# Altium schematic sheet 51-2001-01-13_04 Power Module Schematic.SchDoc
size 431 x 279 mm; Organization: ORGANIZATION; Address1: ADDRESS 1; Address2: ADDRESS 2; Address3: ADDRESS 3; Address4: ADDRESS 4; Revision: -; SheetNumber: 4; SheetTotal: 4; ENG_APP_DATE: --/--/--; DSN_APP_DATE: --/--/--; CHK_APP_DATE: --/--/--
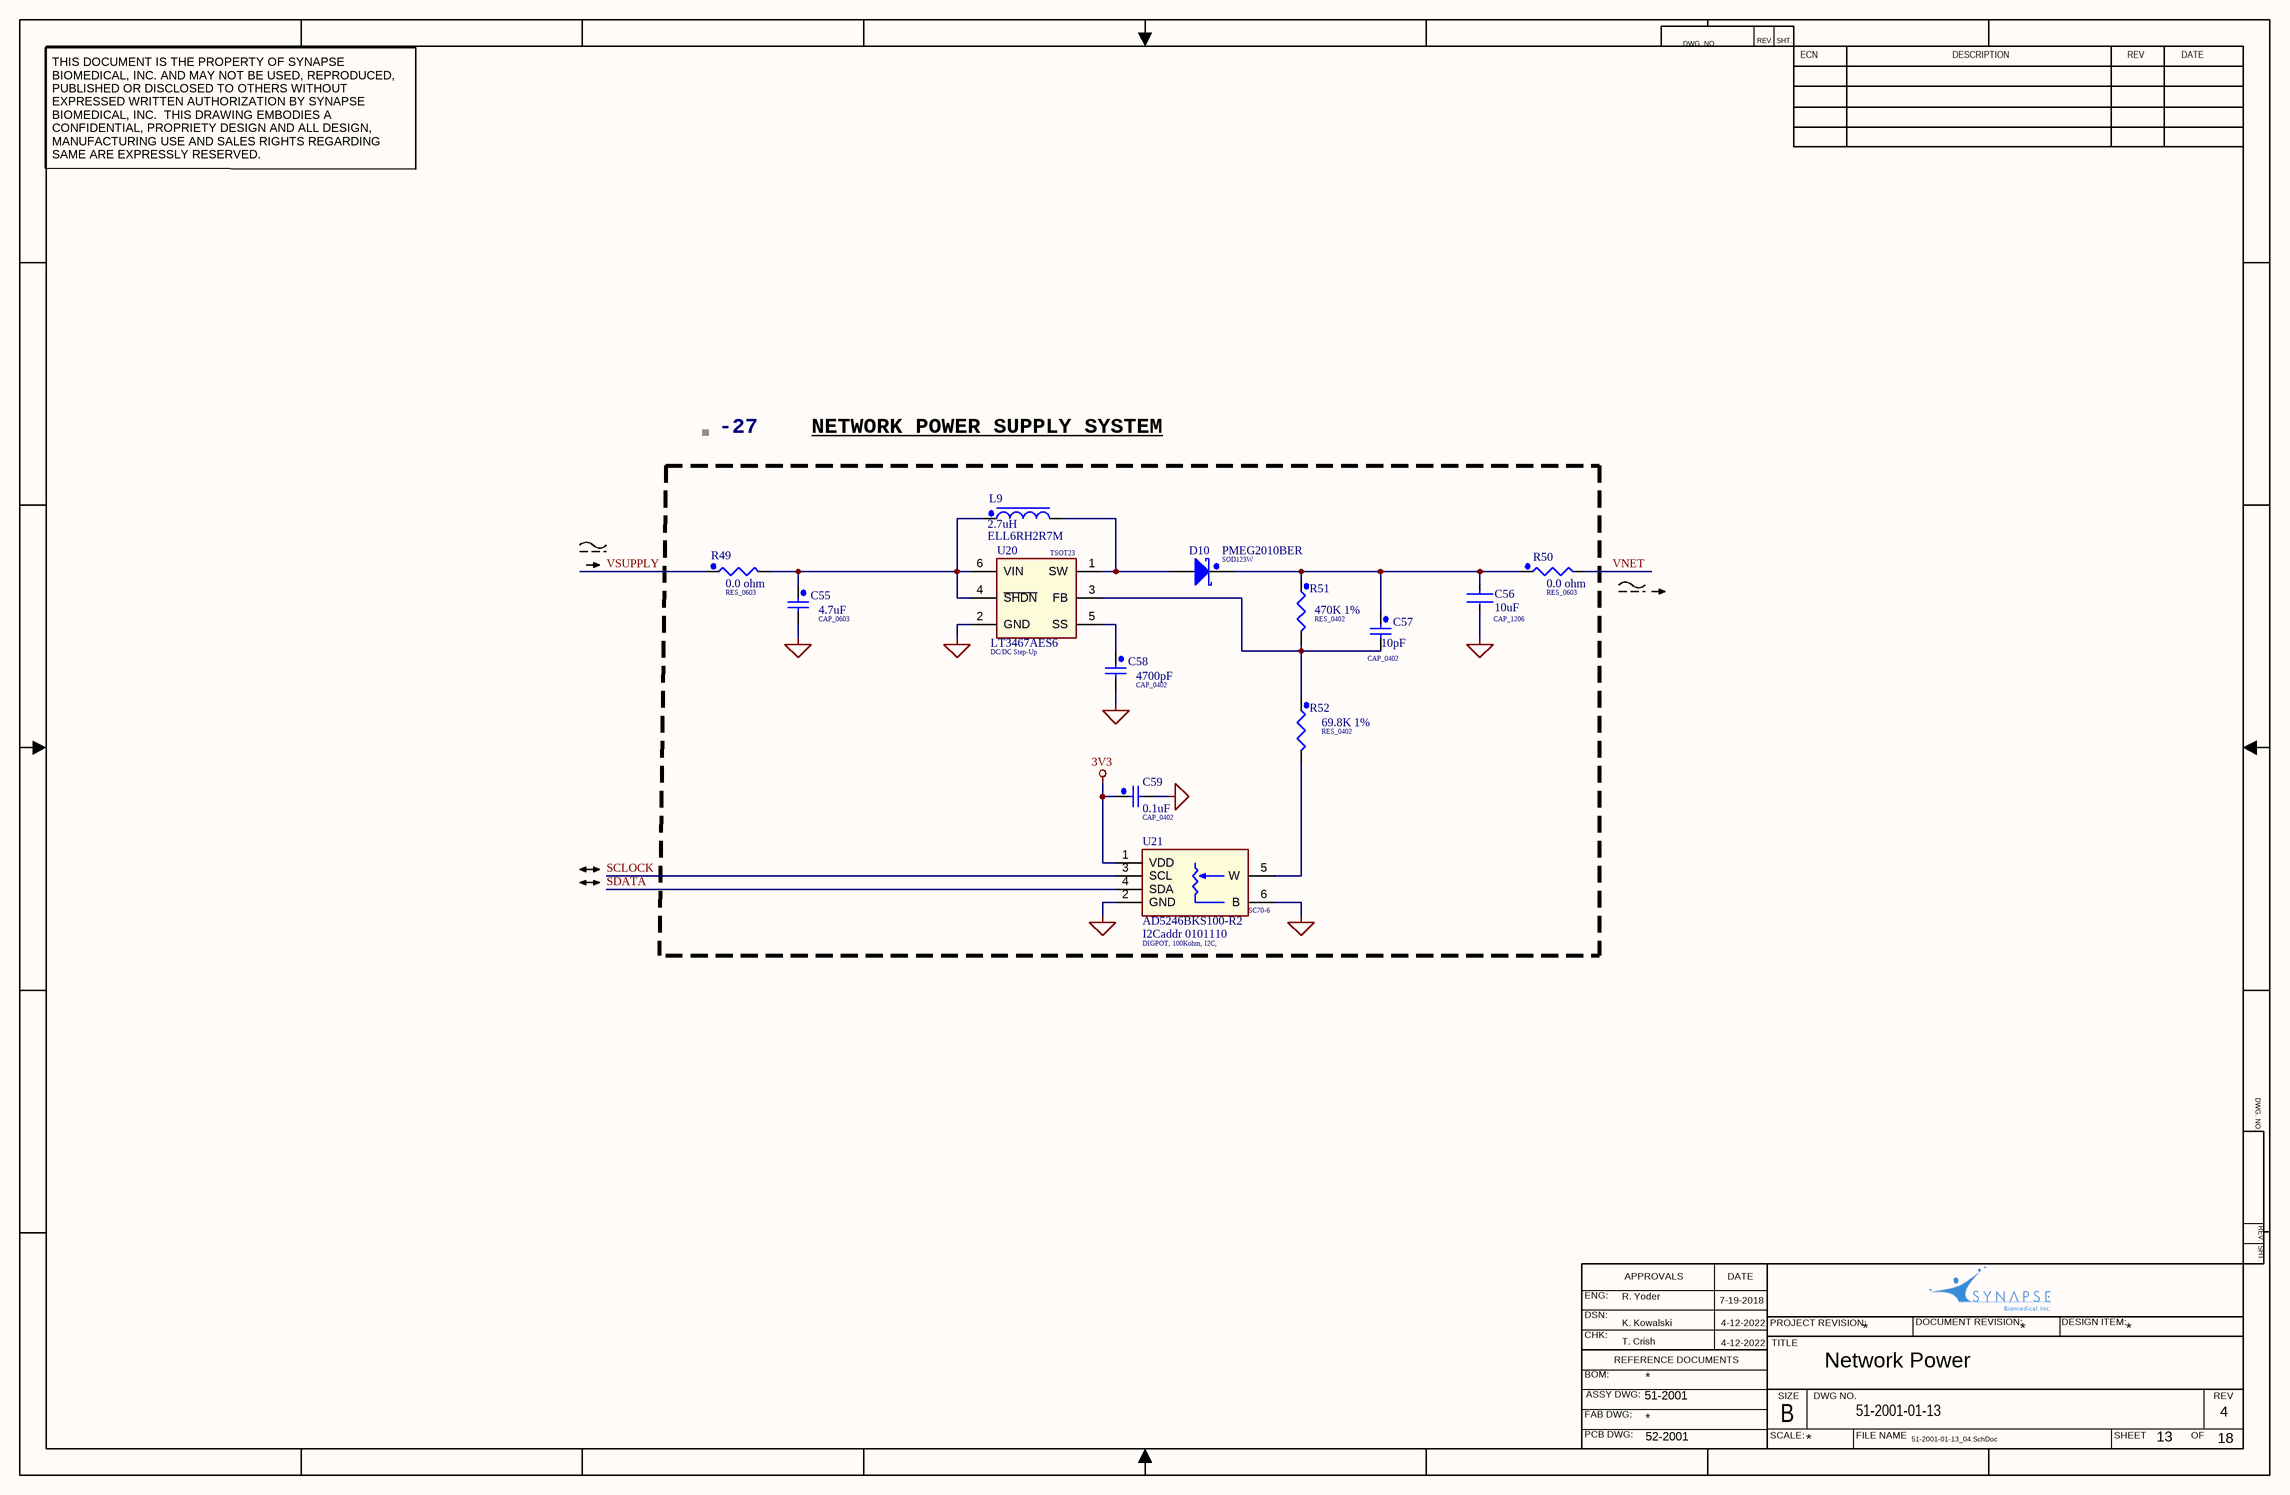
[diagram p0: 51-2001-01-13_04 Power Module Schematic.SchDoc]

## Parts
-27  XDESCRIPTION: NETWORK POWER SUPPLY SYSTEM  (hidden comment: BOM_S1)  (graphical)
C55  value 4.7uF  [CAP_0603]  (hidden comment: C_4u7_X5R_10_0603_10%)
C56  10uF  Case/Package: CAP_1206  [FP-GRT31C-0_2-IPC_A]
C57  value 10pF  [CAP_0402]  (hidden comment: C_10p_C0G_50_0402_5%)
C58  value 4700pF  [CAP_0402]  (hidden comment: C_4n7_C0G_50_0402_10%)
C59  value 0.1uF  [CAP_0402]  (hidden comment: C_100n_X7R_16_0402_10%)
D10  value PMEG2010BER  PackageDescription: SOD123W  [SOD123]  (hidden comment: D_20_1_SOD123W)
L9  value 2.7uH  [IND-ELL-6RH]  (hidden comment: L_2u7_1A8_2626_20%)
R49  value 0.0 ohm  [RES_0603]  (hidden comment: R_0_0603)
R50  value 0.0 ohm  [RES_0603]  (hidden comment: R_0_0603)
R51  value 470K 1%  [RES_0402]  (hidden comment: R_470K)
R52  value 69.8K 1%  [RES_0402]  (hidden comment: R_69k8_0402)
U20  DC/DC Step-Up  PackageDescription: TSOT23  [SOT23-6]
U21  DIGPOT, 100Kohm, I2C,  Note: I2Caddr 0101110  [SC70-6]

## Nets
3V3: C59.1 U21.1(VDD)
GND: C55.2 C56.2 C58.2 C59.2 U20.2(GND) U21.2(GND) U21.6(B)
SCLOCK: U21.3(SCL)
SDATA: U21.4(SDA)
VNET: R50.2
VSUPPLY: R49.1
NetC55_1: C55.1 L9.1 R49.2 U20.4(~{SHDN}) U20.6(VIN)
NetC56_1: C56.1 C57.1 D10.1(C) R50.1 R51.1
NetC57_2: C57.2 R51.2 R52.1 U20.3(FB)
NetC58_1: C58.1 U20.5(SS)
NetD10_2: D10.2(A) L9.2 U20.1(SW)
NetR52_2: R52.2 U21.5(W)

## Notes on the sheet
- DWG. NO.
- REV.
- SHT.
- ECN
- DESCRIPTION
- REV
- DATE
- THIS DOCUMENT IS THE PROPERTY OF SYNAPSE BIOMEDICAL, INC. AND MAY NOT BE USED, REPRODUCED, PUBLISHED OR DISCLOSED TO OTHERS WITHOUT EXPRESSED WRITTEN AUTHORIZATION BY SYNAPSE BIOMEDICAL, INC.  THIS DRAWING EMBODIES A CONFIDENTIAL, PROPRIETY DESIGN AND ALL DESIGN, MANUFACTURING USE AND SALES RIGHTS REGARDING SAME ARE EXPRESSLY RESERVED.
- ENG:
- R. Yoder
- APPROVALS
- 7-19-2018
- DSN:
- CHK:
- REFERENCE DOCUMENTS
- K. Kowalski
- T. Crish
- 4-12-2022
- PROJECT REVISION:
- TITLE
- Network Power
- *
- DOCUMENT REVISION:
- DESIGN ITEM:
- BOM:
- FAB DWG:
- PCB DWG:
- ASSY DWG:
- 51-2001
- SCALE:
- SIZE
- B
- DWG NO.
- 51-2001-01-13
- FILE NAME
- SHEET
- OF
- 4
- 52-2001
- 51-2001-01-13_04.SchDoc
- 13
- 18

## Library data of the parts
-27 = BOM_S1: BOM item small graphic
C55 = LMK107BJ475KA-T: 4.7uF, 10V, X5R, 10%, 0603, RoHS; MFR: Murata Electronics North America; MPN: GRM185R61A475KE11D; SBI: 53-0076; PackageDescription: CAP_0603; Supplier 1: Digi-Key; Supplier Part Number 1: 490-11988-6-ND
C56 = CMP-06035-000076-2: Multi-Layer Ceramic Capacitor 10uF 50V X5R ±10% 1206 Emboss T/R / GRT31CR61H106KE01L; Manufacture 1: Murata Electronics; Length: 0.126inch; Max Operating Temperature: 85°C; Width: 0.063inch; Ratings: AEC-Q200; Voltage Rating: 50V; Dielectric: X5R; Min Operating Temperature: -55°C; Case Code (Imperial): 1206; Capacitance: 10uF; Case Code (Metric): 3216; Thickness: 0.071inch; Tolerance: 10%; Mount: Surface Mount; Packaging: Cut Tape; Voltage Rating (DC): 50V
C57 = GRM1555C1H100JZ01: 10pF, 50V, C0G, 5%, 0402, RoHS; MFR: Murata Electronics North America; MPN: GRM1555C1H100JA01D; SBI: 53-0041-7; PackageDescription: CAP_0402; Supplier 1: Digi-Key; Supplier Part Number 1: 490-5921-6-ND
C58 = C0402C472K5RACTU: 4.7uF, 50V,C0G, 0402, 10%, RoHS; MFR: Murata Electronics North America; MPN: GRM155R71H472KA01D; SBI: 53-0072; PackageDescription: CAP_0402; Supplier 1: Digi-Key; Supplier Part Number 1: 490-1308-6-ND
C59 = GRM155R71C104KA88D: 0.1uF, 16V, X7R, 0402, RoHS; MFR: Murata; SBI: 53-0040-1; PackageDescription: CAP_0402; Supplier 1: Digi-Key; Supplier Part Number 1: 490-3261-2-ND; MPN: GRM155R71C104KA88D
D10 = PMEG2010BER: Schotty Diode, 20V, 1000mA, SOD123W, RoHS; MFR: NXP; MPN: PMEG2010BER,115; SBI: 54-112; Supplier 1: Digi-Key; Supplier Part Number 1: 568-6503-1-ND
L9 = ELL6RH2R7M: 2.7uH, 1.8A, 2626, 20%, RoHS; MFR: Panasonic; SBI: 54-0117; PackageDescription: Pkg; Supplier 1: Digi-Key; Supplier Part Number 1: PCD1339CT-ND; MPN: ELL6RH2R7M
R49 R50 = MCR03ERTJ000: 0.0 ohm, 1/16W, 0603, RoHS; MFR: Vishay Dale; MPN: CRCW06030000Z0EA; SBI: 53-0075; PackageDescription: RES_0603; Supplier 1: Digi-Key; Supplier Part Number 1: 541-1.00KLDKR-ND
R51 = CRCW0402374KFKED: 470K ohm, 1%, 1/16W, 0402,RoHS; MFR: Vishay; MPN: CRCW0402470KFKEDHP; PackageDescription: RES_0402; Supplier 1: Digi-Key; Supplier Part Number 1: 541-470KYCT-ND
R52 = CRCW040243K2FKED: 69.8K, 1%, 1/16W, 0402, RoHS; MFR: Vishay; MPN: CRCW040269K8FKTD; PackageDescription: RES_0402; Supplier 1: Digi-Key; Supplier Part Number 1: 541-CRCW040269K8FKTDCT-ND
U20 = LT3467AES6: DC, Booster, 2.4-16V, TSOT23; MFR: Linear Technology; SBI: 54-0099; Supplier 1: Digi-Key; Supplier Part Number 1: LT3467AES6#TRMPBFDKR-ND; MPN: LT3467AES6; MPN2: LT3467AES6#TRMPBF
U21 = AD5246BKS100-R2: DIGPOT, 100Kohm, I2C, SC70; MFR: Analog Devices; SBI: 54-0100; PackageDescription: SC70-6; Supplier 1: Digi-Key; Supplier Part Number 1: AD5246BKS100-R2CT-ND; Value: *; MPN: AD5246BKS100-R2; MPN2: AD5246BKSZ100-RL7